# Altium schematic sheet Quad-Stage-Prototype_Driver_V1.0.SchDoc: Quad Stage Prototype
size A4; PageSetup: Record=PageOptions|CenterHorizontal=True|CenterVertical=True|PrintScale=0.97|XCorrection=1.00|YCorrection=1.00|PrintKind=0|BorderSize=5000000|LeftOffset=0|BottomOffset=0|Orientation=2|PaperLength=1000|PaperWidth=1000|Scale=100|PaperSource=7|PrintQuality=-3|MediaType=1|DitherType=10|PrintScaleMode=1|PaperKind=A4|PaperIndex=9; Organization: Ostschweizer Fachhochschule; Address2: Florian Baumgartner & Thierry Schwaller; Address3: florian.baumgartner@ost.ch; DocumentNumber: 4; Revision: V1.0; SheetNumber: 4; SheetTotal: 5; Author: Florian Baumgartner & Thierry Schwaller; Subtitle: H-Bridge Driver
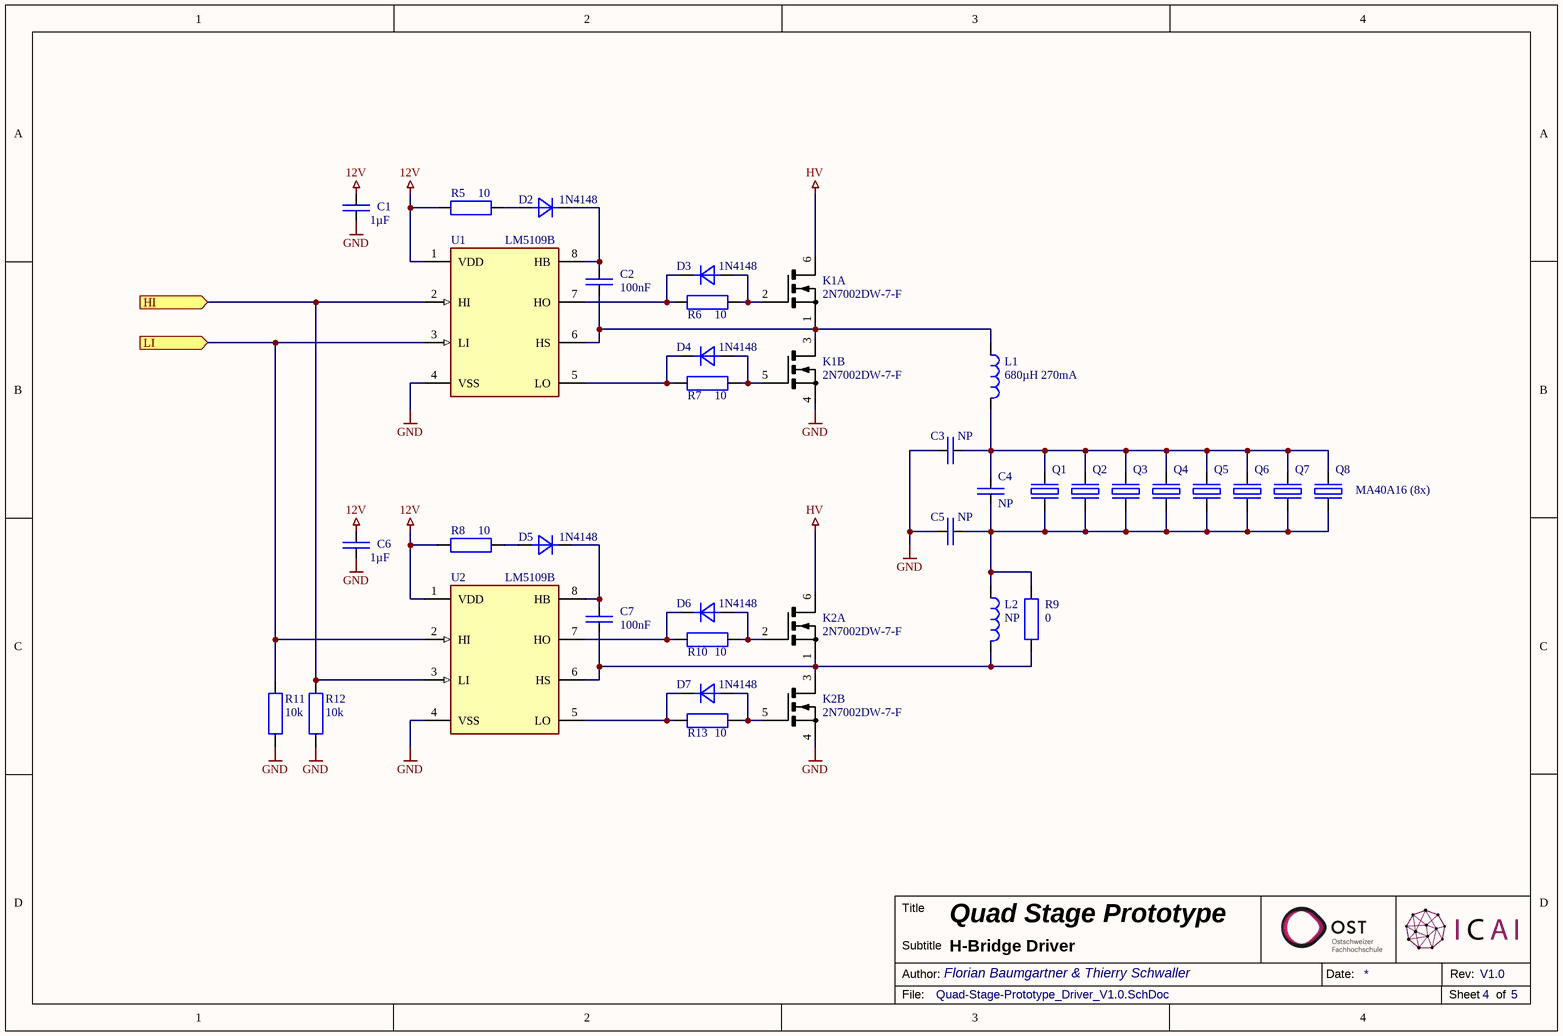
[diagram p0: Quad-Stage-Prototype_Driver_V1.0.SchDoc]

## Parts
C1  1µF  [SMD Keramikkondensator 0603]
C2  100nF  [SMD Keramikkondensator 0603]
C3  NP  [SMD Keramikkondensator 0603]
C4  NP  [SMD Keramikkondensator 0603]
C5  NP  [SMD Keramikkondensator 0603]
C6  1µF  [SMD Keramikkondensator 0603]
C7  100nF  [SMD Keramikkondensator 0603]
D2  1N4148  [SMD Diode SOD-123]
D3  1N4148  [SMD Diode SOD-123]
D4  1N4148  [SMD Diode SOD-123]
D5  1N4148  [SMD Diode SOD-123]
D6  1N4148  [SMD Diode SOD-123]
D7  1N4148  [SMD Diode SOD-123]
K1  2N7002DW-7-F  [SMD IC SOT-363 (SC-70-6)]  (parts A,B of 2)
K2  2N7002DW-7-F  [SMD IC SOT-363 (SC-70-6)]  (parts A,B of 2)
L1  680µH 270mA  [SMD Inductor 7x7x4.5]
L2  NP  [SMD Inductor 7x7x4.5 NP]
Q1  MA40A16  [THT Transducer (MA40A16)]  (value not drawn)
Q2  MA40A16  [THT Transducer (MA40A16)]  (value not drawn)
Q3  MA40A16  [THT Transducer (MA40A16)]  (value not drawn)
Q4  MA40A16  [THT Transducer (MA40A16)]  (value not drawn)
Q5  MA40A16  [THT Transducer (MA40A16)]  (value not drawn)
Q6  MA40A16  [THT Transducer (MA40A16)]  (value not drawn)
Q7  MA40A16  [THT Transducer (MA40A16)]  (value not drawn)
Q8  MA40A16  [THT Transducer (MA40A16)]  (value not drawn)
R5  10  [SMD Widerstand 0603]
R6  10  [SMD Widerstand 0603]
R7  10  [SMD Widerstand 0603]
R8  10  [SMD Widerstand 0603]
R9  0  [SMD Widerstand 0603]
R10  10  [SMD Widerstand 0603]
R11  10k  [SMD Widerstand 0603]
R12  10k  [SMD Widerstand 0603]
R13  10  [SMD Widerstand 0603]
U1  LM5109B  [SMD IC SOIC-8]
U2  LM5109B  [SMD IC SOIC-8]

## Ports
HI (in), LI (in)

## Nets
12V: C1.2 C6.2 R5.2 R8.2 U1.1(VDD) U2.1(VDD)
GND: C1.1 C3.2 C5.2 C6.1 K1.4(S2) K2.4(S2) R11.1 R12.1 U1.4(VSS) U2.4(VSS)
HV: K1.6(D1) K2.6(D1)
HI: R12.2 U1.2(HI) U2.3(LI) ; port HI
LI: R11.2 U1.3(LI) U2.2(HI) ; port LI
NetC2_1: C2.1 K1.1(S1) K1.3(D2) L1.1 U1.6(HS)
NetC2_2: C2.2 D2.K U1.8(HB)
NetC3_1: C3.1 C4.2 L1.2 Q1.2 Q2.2 Q3.2 Q4.2 Q5.2 Q6.2 Q7.2 Q8.2
NetC4_1: C4.1 C5.1 L2.2 Q1.1 Q2.1 Q3.1 Q4.1 Q5.1 Q6.1 Q7.1 Q8.1 R9.2
NetC7_1: C7.1 K2.1(S1) K2.3(D2) L2.1 R9.1 U2.6(HS)
NetC7_2: C7.2 D5.K U2.8(HB)
NetD2_A: D2.A R5.1
NetD3_A: D3.A K1.2(G1) R6.1
NetD3_K: D3.K R6.2 U1.7(HO)
NetD4_A: D4.A K1.5(G2) R7.1
NetD4_K: D4.K R7.2 U1.5(LO)
NetD5_A: D5.A R8.1
NetD6_A: D6.A K2.2(G1) R10.1
NetD6_K: D6.K R10.2 U2.7(HO)
NetD7_A: D7.A K2.5(G2) R13.1
NetD7_K: D7.K R13.2 U2.5(LO)

## Notes on the sheet
- (near Q8) MA40A16 (8x)
- Title
- Author:
- Subtitle
- Date:
- Rev:
- File:
- Sheet
- of

## Library data of the parts
C1 C6 = C-CAPACITOR: CAP-MK; Component Description: Multilayer Ceramic Capacitors; Component Value: 1µF 50V; Digikey: 1276-1860-1-ND; Farnell: 3013383; Mouser: 187-CL10A105KB8NNNC; JLC-Parts: C15849; Unit Price: 0.01
C2 C7 = C-CAPACITOR: CAP-MK; Component Description: Multilayer Ceramic Capacitors; Component Value: 100nF 50V; Digikey: 445-5666-1-ND; Farnell: 2522432; Mouser: 77-VJ0603V104ZXAPBC; JLC-Parts: C14663; Unit Price: 0.01
C3-C5 = C-CAPACITOR: CAP-MK; Component Description: Multilayer Ceramic Capacitors; Component Value: NP
D2-D7 = R-DIODE: DIODE (alt V); Component Description: Fast Switching Diode; Component Value: 1N4148WTR; Digikey: 1655-1360-1-ND; Farnell: 2306363; Mouser: 750-1N4148W-HF; ComponentLink1Description: Datasheet; ComponentLink1URL: https://datasheet.lcsc.com/lcsc/1811061725_ST-Semtech-1N4148W_C81598.pdf; JLC-Parts: C81598; Unit Price: 0.01
K1 K2 = K-2N7002DW-7-F: Dual N-Channel MOSFET; Digikey: 2N7002DW-FDICT-ND; Mouser: 621-2N7002DW-F; ComponentLink1Description: Datasheet; ComponentLink1URL: https://datasheet.lcsc.com/lcsc/1810111020_Diodes-Incorporated-2N7002DW-7-F_C83571.pdf; JLC-Parts: C83571; Component Description: Dual N-Channel MOSFET; Component Value: 2N7002DW-7-F; Unit Price: 0.35
L1 = L-COIL: Shielded Power Inductor; Component Value: SLF7045T-681MR20-PF (680µH 270mA); ComponentLink1Description: Datasheet; ComponentLink1URL: https://datasheet.lcsc.com/lcsc/1806061130_TDK-SLF7045T-681MR20-PF_C91522.pdf; Digikey: 445-2028-1-ND; Farnell: 2215732; JLC-Parts: C91522; Mouser: 810-SLF7045T-681M; Component Description: Shielded Power Inductor; Unit Price: 0.32
L2 = L-COIL: Shielded Power Inductor; ComponentLink1Description: Datasheet; Component Description: Shielded Power Inductor
Q1-Q8 = Q-Piezo: Ultrasonic Transducer; Component Value: MA40A16 (40kHz, 16mm); ComponentLink1Description: Datasheet; Component Description: Ultrasonic Transducer; Unit Price: 0.40
  Q2-Q8: JLC-Parts: C115962
R5-R8 R10 R13 = R-RESISTOR: RES (E=Heizwiderstand B=Messwandler); Component Description: Thick Film Chip Resistor; Component Value: 10 (75V, 100mW, 1%); Digikey: P10.0HCT-ND; Farnell: 2302958; Mouser: 667-ERJ-3EKF10R0V; JLC-Parts: C22859; Unit Price: 0.01
R9 = R-RESISTOR: RES (E=Heizwiderstand B=Messwandler); Component Description: Thick Film Chip Resistor; Component Value: 0 (75V, 100mW, 1%); Digikey: 311-0.0GRCT-ND; Farnell: 9233130; Mouser: 603-RC0603JR-070RL; JLC-Parts: C21189; Unit Price: 0.01
R11 R12 = R-RESISTOR: RES (E=Heizwiderstand B=Messwandler); Component Description: Thick Film Chip Resistor; Component Value: 10k (75V, 100mW, 1%); Digikey: P10.0KHCT-ND; Farnell: 2303192; Mouser: 667-ERJ-3EKF1002V; JLC-Parts: C25804; Unit Price: 0.01
U1 U2 = U-LM5109B: High Voltage 1A Peak Half Bridge Gate Driver; Component Description: High Voltage Gate Driver; ComponentLink1Description: Datasheet; ComponentLink1URL: https://datasheet.lcsc.com/lcsc/1809172040_Texas-Instruments-LM5109AMAX-NOPB_C129332.pdf; Digikey: LM5109BMA/NOPB-ND; Component Value: LM5109B; Farnell: 3005776; JLC-Parts: C116862; Mouser: 926-LM5109BMAX/NOPB; Unit Price: 1.13